# EAGLE schematic TankWaterControllerV5.1.10 (EAGLE 9.6.2)
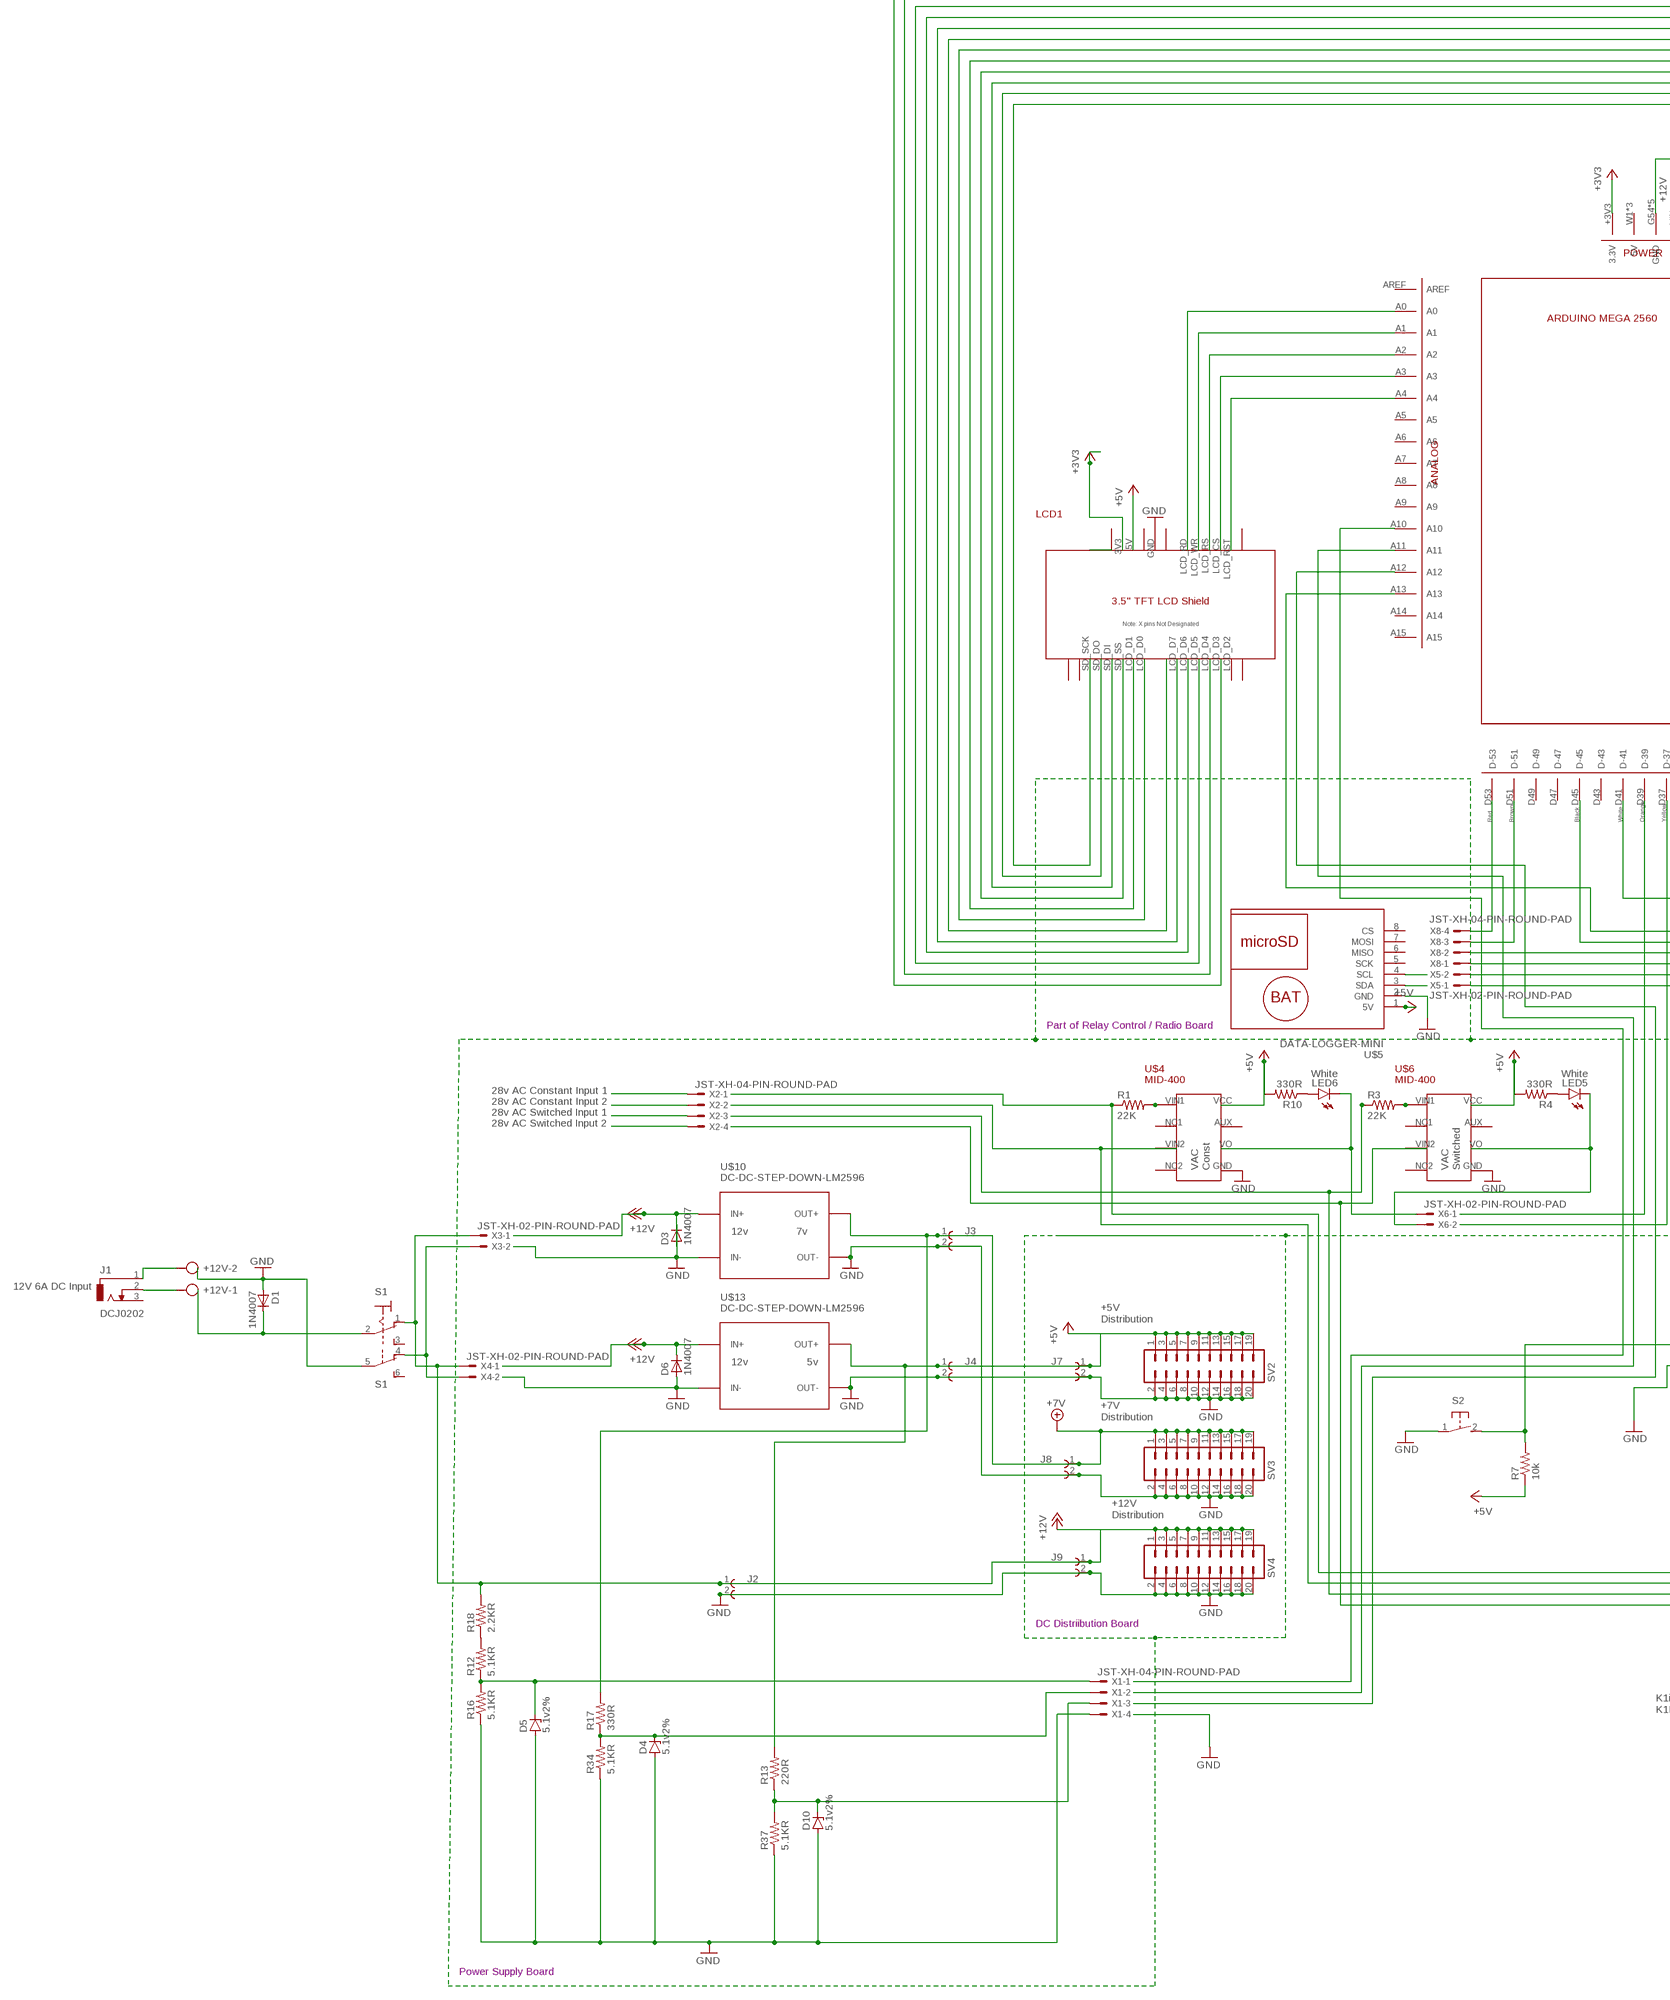
[diagram p0: schematic, sheet 1, part 1 of 2]
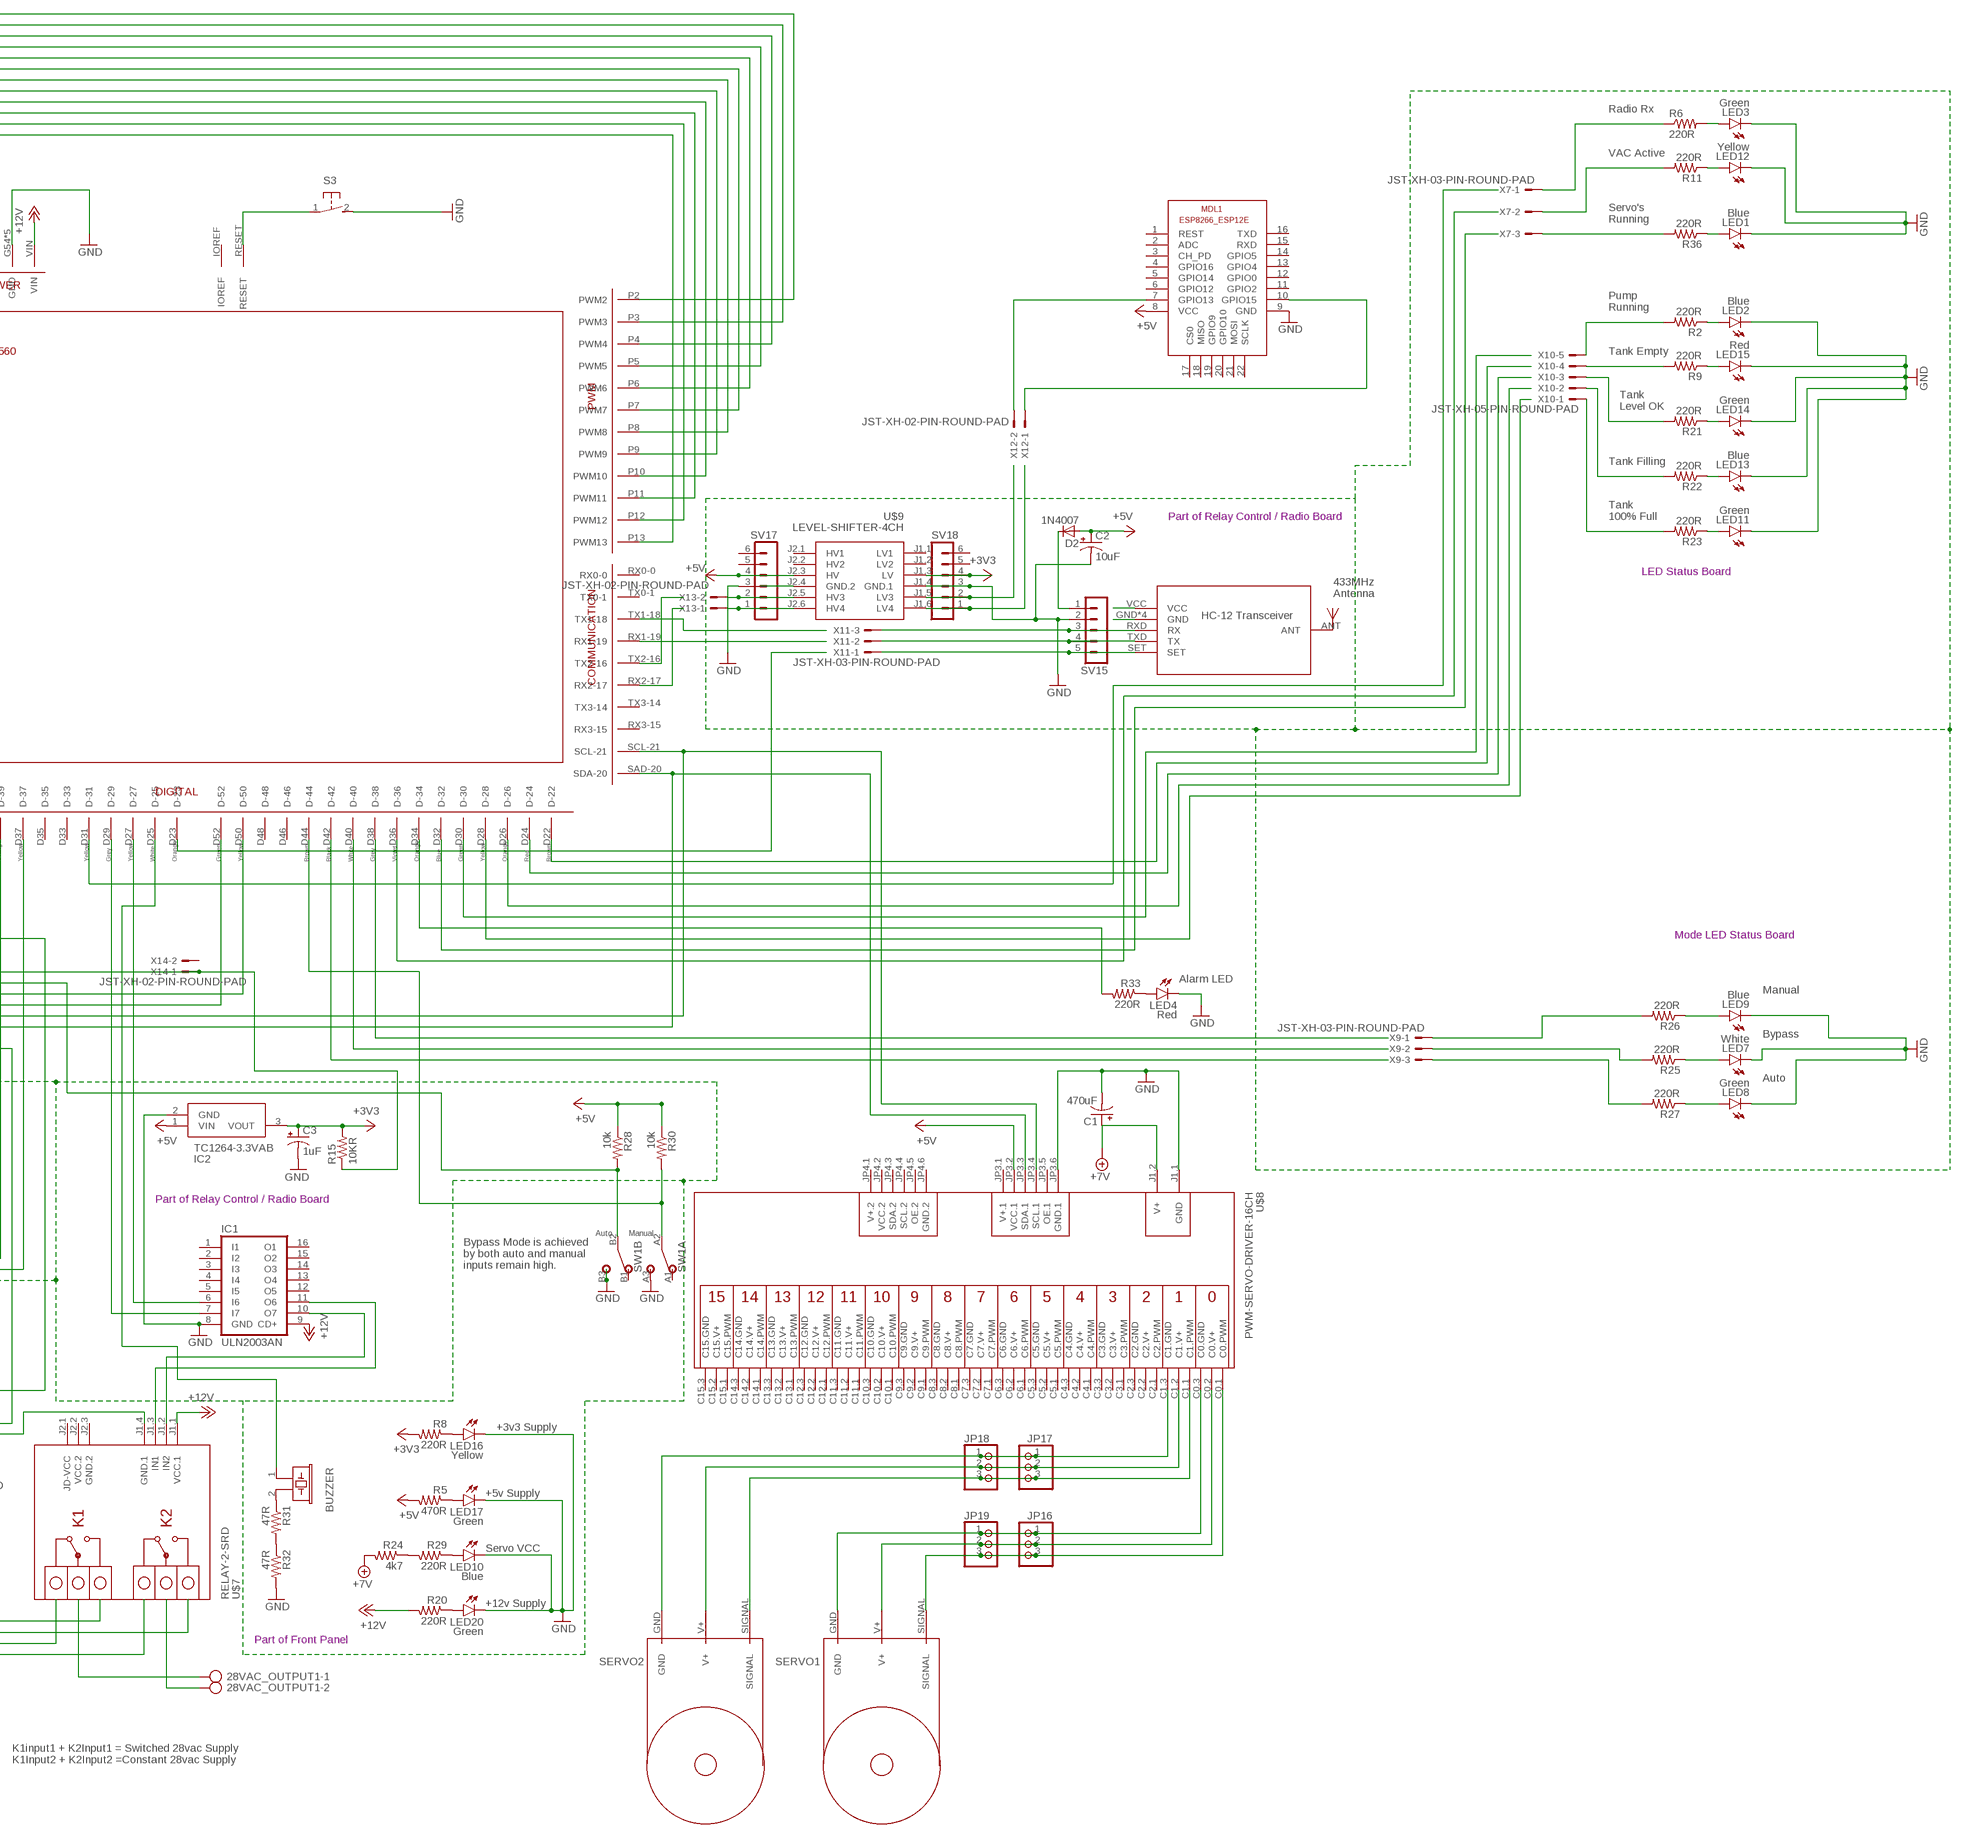
[diagram p1: schematic, sheet 1, part 2 of 2]

## Parts
28VAC_OUTPUT1  AK300/2  [AK300/2]
+12V  AK300/2  [AK300/2]
BUZZER  EFBAA40D101  [EFBAA40D101]
C1  470uF  CPOL-USB45181A  [B45181A]
C2  10uF  CPOL-USB45181A  [B45181A]
C3  1uF  CPOL-USB45181A  [B45181A]
D1  1N4007  [SMA]
D2  1N4007  [SMA]
D3  1N4007  [SMA]
D4  5.1v2%  ZENER-DIODEZD-5  [ZDIO-5]
D5  5.1v2%  ZENER-DIODEZD-5  [ZDIO-5]
D6  1N4007  [SMA]
D10  5.1v2%  ZENER-DIODEZD-5  [ZDIO-5]
IC1  ULN2003AN  [DIL16]
IC2  TC1264-3.3VAB  [TO254P483X988X2222-3P]
J1  DCJ0202  [DCJ0202]
J2  691101710002  [691101710002]
J3  691101710002  [691101710002]
J4  691101710002  [691101710002]
J7  691101710002  [691101710002]
J8  691101710002  [691101710002]
J9  691101710002  [691101710002]
JP16  PINHD-1X3/L90  [1X03/90]
JP17  PINHD-1X3/L90  [1X03/90]
JP18  PINHD-1X3/L90  [1X03/90]
JP19  PINHD-1X3/L90  [1X03/90]
LCD1  LCD_TOUCH_SHIELD  [LCD_TOUCH_3.5]
LED1  Blue  LED3MM  [LED3MM]
LED2  Blue  LED3MM  [LED3MM]
LED3  Green  LED3MM  [LED3MM]
LED4  Red  LED3MM  [LED3MM]
LED5  White  LED3MM  [LED3MM]
LED6  White  LED3MM  [LED3MM]
LED7  White  LED3MM  [LED3MM]
LED8  Green  LED3MM  [LED3MM]
LED9  Blue  LED3MM  [LED3MM]
LED10  Blue  LED3MM  [LED3MM]
LED11  Green  LED3MM  [LED3MM]
LED12  Yellow  LED3MM  [LED3MM]
LED13  Blue  LED3MM  [LED3MM]
LED14  Green  LED3MM  [LED3MM]
LED15  Red  LED3MM  [LED3MM]
LED16  Yellow  LED3MM  [LED3MM]
LED17  Green  LED3MM  [LED3MM]
LED20  Green  LED3MM  [LED3MM]
MDL1  ESP8266-12EESP8266-ESP12E  [ESP8266-ESP12E]
R1  22K  R-US_0204/5  [0204/5]
R2  220R  R-US_0204/5  [0204/5]
R3  22K  R-US_0204/5  [0204/5]
R4  330R  R-US_0204/5  [0204/5]
R5  470R  R-US_0204/5  [0204/5]
R6  220R  R-US_0204/5  [0204/5]
R7  10k  R-US_0204/5  [0204/5]
R8  220R  R-US_0204/5  [0204/5]
R9  220R  R-US_0204/5  [0204/5]
R10  330R  R-US_0204/5  [0204/5]
R11  220R  R-US_0204/5  [0204/5]
R12  5.1KR  R-US_0204/5  [0204/5]
R13  220R  R-US_0204/5  [0204/5]
R15  10KR  R-US_0204/5  [0204/5]
R16  5.1KR  R-US_0204/5  [0204/5]
R17  330R  R-US_0204/5  [0204/5]
R18  2.2KR  R-US_0204/5  [0204/5]
R20  220R  R-US_0204/5  [0204/5]
R21  220R  R-US_0204/5  [0204/5]
R22  220R  R-US_0204/5  [0204/5]
R23  220R  R-US_0204/5  [0204/5]
R24  4k7  R-US_0204/5  [0204/5]
R25  220R  R-US_0204/5  [0204/5]
R26  220R  R-US_0204/5  [0204/5]
R27  220R  R-US_0204/5  [0204/5]
R28  10k  R-US_0204/5  [0204/5]
R29  220R  R-US_0204/5  [0204/5]
R30  10k  R-US_0204/5  [0204/5]
R31  47R  R-US_0204/5  [0204/5]
R32  47R  R-US_0204/5  [0204/5]
R33  220R  R-US_0204/5  [0204/5]
R34  5.1KR  R-US_0204/5  [0204/5]
R36  220R  R-US_0204/5  [0204/5]
R37  5.1KR  R-US_0204/5  [0204/5]
S1  320-938  [320-938]
S2  31-XX  [B3F-31XX]
S3  31-XX  [B3F-31XX]
SERVO1  SERVO-DCBASIC_DC_SERVO  [BASIC_DC_SERVO]
SERVO2  SERVO-DCBASIC_DC_SERVO  [BASIC_DC_SERVO]
SV2  MA10-2W  [MA10-2W]
SV3  MA10-2W  [MA10-2W]
SV4  MA10-2W  [MA10-2W]
SV15  MA05-1  [MA05-1]
SV17  MA06-1  [MA06-1]
SV18  MA06-1  [MA06-1]
SW1  3PDT  [3PDT]
U$1  BOARD_ARDUINO-MEGA  [BOARD_ARDUINO_MEGA]
U$2  HC-12_FOOTPRINT  [HC-12_FOOTPRINT]
U$3  ANTENNA  [ANTENNA]
U$4  MID-400  [MID-400]
U$5  DATA-LOGGER-MINI  [DATA-LOGGER-MINI]
U$6  MID-400  [MID-400]
U$7  RELAY-2-SRD  [RELAY-2-SRD]
U$8  PWM-SERVO-DRIVER-16CH  [PWM-SERVO-DRIVER-16CH]
U$9  LEVEL-SHIFTER-4CH  [LEVEL-SHIFTER-4CH]
U$10  DC-DC-STEP-DOWN-LM2596  [DC-DC-STEP-DOWN-LM2596]
U$13  DC-DC-STEP-DOWN-LM2596  [DC-DC-STEP-DOWN-LM2596]
X1  JST-XH-04-PIN-ROUND-PAD  [JST-XH-04-PACKAGE-ROUND-PAD]
X2  JST-XH-04-PIN-ROUND-PAD  [JST-XH-04-PACKAGE-ROUND-PAD]
X3  JST-XH-02-PIN-ROUND-PAD  [JST-XH-02-PACKAGE-ROUND-PAD]
X4  JST-XH-02-PIN-ROUND-PAD  [JST-XH-02-PACKAGE-ROUND-PAD]
X5  JST-XH-02-PIN-ROUND-PAD  [JST-XH-02-PACKAGE-ROUND-PAD]
X6  JST-XH-02-PIN-ROUND-PAD  [JST-XH-02-PACKAGE-ROUND-PAD]
X7  JST-XH-03-PIN-ROUND-PAD  [JST-XH-03-PACKAGE-ROUND-PAD]
X8  JST-XH-04-PIN-ROUND-PAD  [JST-XH-04-PACKAGE-ROUND-PAD]
X9  JST-XH-03-PIN-ROUND-PAD  [JST-XH-03-PACKAGE-ROUND-PAD]
X10  JST-XH-05-PIN-ROUND-PAD  [JST-XH-05-PACKAGE-ROUND-PAD]
X11  JST-XH-03-PIN-ROUND-PAD  [JST-XH-03-PACKAGE-ROUND-PAD]
X12  JST-XH-02-PIN-ROUND-PAD  [JST-XH-02-PACKAGE-ROUND-PAD]
X13  JST-XH-02-PIN-ROUND-PAD  [JST-XH-02-PACKAGE-ROUND-PAD]
X14  JST-XH-02-PIN-ROUND-PAD  [JST-XH-02-PACKAGE-ROUND-PAD]

## Nets
+3V3: C3.+ IC2.3(VOUT) LCD1.3V3 R8.2 R15.2 SV18.4 U$1.+3V3(3.3V) U$9.J1.3(LV)
+5V: C2.+ D2.A IC2.1(VIN) LCD1.5V MDL1.8(VCC) R4.2 R5.2 R7.1 R10.2 R28.1 R30.1 SV2.1 SV2.3 SV2.5 SV2.7 SV2.9 SV2.11 SV2.13 SV2.15 SV2.17 SV2.19 SV17.4 U$4.VCC U$5.1(5V) U$6.VCC U$8.JP3.2(VCC.1) U$9.J2.3(HV)
+7V: J3.1 J8.1 R17.2 R24.2 U$10.OUT+
+12V: D3.A D6.K(C) IC1.9(CD+) R20.2 SV4.1 SV4.3 SV4.5 SV4.7 SV4.9 SV4.11 SV4.13 SV4.15 SV4.17 SV4.19 U$1.VIN U$7.J1.1(VCC.1) U$10.IN+ U$13.IN+
GND: C1.- C2.- C3.- D1.A D3.K(C) D4.A D5.A D6.A D10.A IC1.8(GND) IC2.2(GND) J2.2 J3.2 J4.2 J7.2 J8.2 J9.2 LED1.K(C) LED2.K(C) LED3.K(C) LED4.K(C) LED7.K(C) LED8.K(C) LED9.K(C) LED10.K(C) LED11.K(C) LED12.K(C) LED13.K(C) LED14.K(C) LED15.K(C) LED16.K(C) LED17.K(C) LED20.K(C) MDL1.9(GND) R16.1 R32.2 R34.1 R37.1 S1.5(B:P) S2.1(P) S3.2(S) SV2.2 SV2.4 SV2.6 SV2.8 SV2.10 SV2.12 SV2.14 SV2.16 SV2.18 SV2.20 SV3.2 SV3.4 SV3.6 SV3.8 SV3.10 SV3.12 SV3.14 SV3.16 SV3.18 SV3.20 SV4.2 SV4.4 SV4.6 SV4.8 SV4.10 SV4.12 SV4.14 SV4.16 SV4.18 SV4.20 SV15.2 SV17.3 SV18.3 SW1.A3 SW1.B3 U$1.G54(GND) U$1.G55(GND) U$1.G56(GND) U$1.G57(GND) U$1.G58(GND) U$5.2(GND) U$7.J1.4(GND.1) U$8.J1.1(GND) U$8.JP3.6(GND.1) U$9.J1.4(GND.1) U$10.IN- U$10.OUT- U$13.IN- U$13.OUT- X1.4
N$1: LCD1.P$28(X8)
N$2: R25.2 X9.2
N$3: +12V.1 J1.2
N$4: D1.K(C) S1.2(1:P)
N$5: LCD1.LCD_RD U$1.A0
N$6: LCD1.LCD_WR U$1.A1
N$7: LCD1.LCD_RS U$1.A2
N$8: LCD1.LCD_CS U$1.A3
N$9: LCD1.LCD_RST U$1.A4
N$10: LCD1.SD_SCK U$1.P13(PWM13)
N$11: LCD1.SD_DO U$1.P12(PWM12)
N$12: LCD1.SD_DI U$1.P11(PWM11)
N$13: LCD1.SD_SS U$1.P10(PWM10)
N$14: LCD1.LCD_D1 U$1.P9(PWM9)
N$15: LCD1.LCD_D0 U$1.P8(PWM8)
N$16: LCD1.P$2(X2) U$1.P7(PWM7)
N$17: LCD1.LCD_D7 U$1.P6(PWM6)
N$18: LCD1.LCD_D6 U$1.P5(PWM5)
N$19: LCD1.LCD_D5 U$1.P4(PWM4)
N$20: LCD1.LCD_D4 U$1.P3(PWM3)
N$21: LCD1.LCD_D3 U$1.P2(PWM2)
N$22: U$1.D50(D-50) X8.2
N$23: MDL1.7(GPIO13) X12.2
N$24: U$2.ANT U$3.ANT
N$25: U$1.D51(D-51) X8.3
N$26: LED16.A R8.1
N$27: U$4.VIN2
N$28: R3.1
N$29: IC1.11(O6) U$7.J1.3(IN1)
N$30: LED6.K(C) U$4.VO(V0) X6.1
N$31: U$6.VIN2
N$32: LED1.A R36.1
N$34: U$1.D52(D-52) X8.1
N$35: R1.2
N$36: R3.2
N$38: R1.1
N$39: U$1.D36(D-36)
N$40: +12V.2 J1.1
N$41: IC1.7(I7) U$1.D29(D-29)
N$42: IC1.6(I6) U$1.D27(D-27)
N$44: 28VAC_OUTPUT1.1
N$45: X2.3
N$46: IC1.10(O7) U$7.J1.2(IN2)
N$47: 28VAC_OUTPUT1.2
N$48: U$1.A10
N$49: LED6.A R10.1
N$50: D5.C R12.1 R16.2 X1.1
N$51: R30.2 SW1.A2 U$1.D44(D-44)
N$52: R28.2 SW1.B2 U$1.D45(D-45)
N$53: R12.2 R18.1
N$54: JP17.2 JP18.2 SERVO2.V+ U$8.C1.2(C1.V+)
N$55: U$1.SCL-21 U$8.JP3.4(SCL.1) X5.2
N$56: D10.C R13.1 R37.2 X1.3
N$57: U$5.4(SCL)
N$58: U$2.VCC
N$59: LED11.A R23.1
N$60: LED20.A R20.1
N$61: LED5.A R4.1
N$62: X2.4
N$63: U$1.A12
N$64: LED17.A R5.1
N$65: U$2.GND U$2.GND1(GND) U$2.GND2(GND) U$2.MCHFIX(GND)
N$66: LED9.A R26.1
N$67: U$5.3(SDA)
N$68: S3.1(P) U$1.RESET
N$69: U$1.D53(D-53) X8.4
N$70: R26.2 X9.1
N$71: U$1.SAD-20(SDA-20) U$8.JP3.3(SDA.1) X5.1
N$72: SV15.3 U$2.RXD(RX) X11.3
N$73: U$1.D22(D-22)
N$74: SV15.4 U$2.TXD(TX) X11.2
N$75: MDL1.10(GPIO15) X12.1
N$76: LED3.A R6.2
N$77: R27.2 X9.3
N$78: BUZZER.1 U$1.D25(D-25)
N$79: X2.1
N$80: U$1.D39(D-39)
N$81: LED7.A R25.1
N$82: LED12.A R11.1
N$83: LED15.A R9.1
N$84: U$1.RX2-17
N$85: LED2.A R2.1
N$86: U$1.D38(D-38)
N$87: U$1.TX1-18
N$88: U$1.D42(D-42)
N$89: U$1.D40(D-40)
N$90: S1.4(B:O) X3.2 X4.2
N$91: U$1.TX2-16
N$92: BUZZER.2 R31.1
N$93: U$1.D26(D-26)
N$94: U$1.D28(D-28)
N$95: LED8.A R27.1
N$96: D2.K(C) SV15.1
N$97: U$1.D23(D-23)
N$98: U$9.J2.4(GND.2)
N$99: U$1.D32(D-32)
N$100: SV18.2 U$9.J1.5(LV3)
N$101: U$1.D30(D-30)
N$102: R31.2 R32.1
N$103: R24.1 R29.2
N$104: LED13.A R22.1
N$105: LED14.A R21.1
N$106: LED10.A R29.1
N$107: J2.1 J9.1 R18.2 S1.1(1:O) X3.1 X4.1
N$108: U$1.D24(D-24)
N$109: U$1.D31(D-31)
N$111: J4.1 J7.1 R13.2 U$13.OUT+
N$112: U$1.RX1-19
N$113: X2.2
N$114: LED4.A R33.1
N$115: R7.2 S2.2(S) U$1.D41(D-41)
N$116: U$1.D37(D-37)
N$117: LED5.K(C) U$6.VO(V0) X6.2
N$118: U$1.A11
N$119: R33.2 U$1.D34(D-34)
N$120: JP16.1 JP19.1 SERVO1.GND U$8.C0.3(C0.GND)
N$121: R6.1 X7.1
N$122: JP17.1 JP18.1 SERVO2.GND U$8.C1.3(C1.GND)
N$124: SV15.5 U$2.SET X11.1
N$125: SV18.1 U$9.J1.6(LV4)
N$126: JP16.2 JP19.2 SERVO1.V+ U$8.C0.2(C0.V+)
N$127: JP16.3 JP19.3 SERVO1.SIGNAL U$8.C0.1(C0.PWM)
N$128: C1.+ U$8.J1.2(V+) ; supply symbol labelled +7V
N$129: SV17.1 U$9.J2.6(HV4) X13.1
N$130: R11.2 X7.2
N$131: JP17.3 JP18.3 SERVO2.SIGNAL U$8.C1.1(C1.PWM)
N$132: R36.2 X7.3
N$133: R2.2 X10.5
N$134: R9.2 X10.4
N$135: R21.2 X10.3
N$136: R22.2 X10.2
N$137: R23.2 X10.1
N$138: SV17.2 U$9.J2.5(HV3) X13.2
N$139: SV3.1 SV3.3 SV3.5 SV3.7 SV3.9 SV3.11 SV3.13 SV3.15 SV3.17 SV3.19
N$142: R15.1 U$1.A13 X14.1
N$143: D4.C R17.1 R34.2 X1.2
Unconnected: IC1.1(I1) IC1.2(I2) IC1.3(I3) IC1.4(I4) IC1.5(I5) IC1.12(O5) IC1.13(O4) IC1.14(O3) IC1.15(O2) IC1.16(O1) J1.3 LCD1.GND LCD1.LCD_D2 LCD1.P$1(X1) LCD1.P$7(X3) LCD1.P$8(X4) LCD1.P$17(X5) LCD1.P$23(X6) LCD1.P$25(X7) MDL1.1(REST) MDL1.2(ADC) MDL1.3(CH_PD) MDL1.4(GPIO16) MDL1.5(GPIO14) MDL1.6(GPIO12) MDL1.11(GPIO2) MDL1.12(GPIO0) MDL1.13(GPIO4) MDL1.14(GPIO5) MDL1.15(RXD) MDL1.16(TXD) MDL1.17(CS0) MDL1.18(MISO) MDL1.19(GPIO9) MDL1.20(GPIO10) MDL1.21(MOSI) MDL1.22(SCLK) S1.3(1:S) S1.6(B:S) SV17.5 SV17.6 SV18.5 SV18.6 SW1.A1 SW1.B1 SW1.C1 SW1.C2 SW1.C3 U$1.A5 U$1.A6 U$1.A7 U$1.A8 U$1.A9 U$1.A14 U$1.A15 U$1.AREF U$1.D33(D-33) U$1.D35(D-35) U$1.D43(D-43) U$1.D46(D-46) U$1.D47(D-47) U$1.D48(D-48) U$1.D49(D-49) U$1.IOREF U$1.RX0-0 U$1.RX3-15 U$1.TX0-1 U$1.TX3-14 U$4.AUX U$4.GND U$4.NC1 U$4.NC2 U$4.VIN1 U$5.5(SCK) U$5.6(MISO) U$5.7(MOSI) U$6.AUX U$6.GND U$6.NC1 U$6.NC2 U$6.VIN1 U$7.J2.1(JD-VCC) U$8.C2.1(C2.PWM) U$8.C2.2(C2.V+) U$8.C2.3(C2.GND) U$8.C3.1(C3.PWM) U$8.C3.2(C3.V+) U$8.C3.3(C3.GND) U$8.C4.1(C4.PWM) U$8.C4.2(C4.V+) U$8.C4.3(C4.GND) U$8.C5.1(C5.PWM) U$8.C5.2(C5.V+) U$8.C5.3(C5.GND) U$8.C6.1(C6.PWM) U$8.C6.2(C6.V+) U$8.C6.3(C6.GND) U$8.C7.1(C7.PWM) U$8.C7.2(C7.V+) U$8.C7.3(C7.GND) U$8.C8.1(C8.PWM) U$8.C8.2(C8.V+) U$8.C8.3(C8.GND) U$8.C9.1(C9.PWM) U$8.C9.2(C9.V+) U$8.C9.3(C9.GND) U$8.C10.1(C10.PWM) U$8.C10.2(C10.V+) U$8.C10.3(C10.GND) U$8.C11.1(C11.PWM) U$8.C11.2(C11.V+) U$8.C11.3(C11.GND) U$8.C12.1(C12.PWM) U$8.C12.2(C12.V+) U$8.C12.3(C12.GND) U$8.C13.1(C13.PWM) U$8.C13.2(C13.V+) U$8.C13.3(C13.GND) U$8.C14.1(C14.PWM) U$8.C14.2(C14.V+) U$8.C14.3(C14.GND) U$8.C15.1(C15.PWM) U$8.C15.2(C15.V+) U$8.C15.3(C15.GND) U$8.JP3.5(OE.1) U$8.JP4.3(SDA.2) U$8.JP4.4(SCL.2) U$8.JP4.5(OE.2) U$9.J1.1(LV1) U$9.J1.2(LV2) U$9.J2.1(HV1) U$9.J2.2(HV2) X14.2

## Notes on the sheet
- Radio Rx
- VAC Active
- Servo's
  Running
- Pump
  Running
- Tank Empty
- Tank 
  Level OK
- Tank Filling
- Part of Relay Control / Radio Board
- Tank 
  100% Full
- LED Status Board
- 433MHz
  Antenna
- HC-12 Transceiver
- Red | Brown | Black | White | Orange | Yellow | Yellow | Grey | Yellow | White | Orange | Green | Yellow | Brown | Black | White | Grey | Violet | Orange | Blue | Green | Yellow | Orange | Red | Brown
- Mode LED Status Board
- Alarm LED
- Manual
- Bypass
- Part of Relay Control / Radio Board
- Auto
- 28v AC Constant Input 1
- 28v AC Constant Input 2
- 28v AC Switched Input 1
- 28v AC Switched Input 2
- Part of Relay Control / Radio Board
- VAC 
  Const
- VAC 
  Switched
- Auto | Manual
- Bypass Mode is achieved
  by both auto and manual 
  inputs remain high.
- 12v | 7v
- 12V 6A DC Input
- +5V
  Distribution
- 12v | 5v | +3v3 Supply
- +7V
  Distribution
- +5v Supply
- Servo VCC
- +12V
  Distribution
- +12v Supply
- Part of Front Panel
- DC Distriibution Board
- K1input1 + K2Input1 = Switched 28vac Supply 
  K1Input2 + K2Input2 =Constant 28vac Supply
- Power Supply Board

## Power pins joined to a net without a drawn wire
5V: U$1.W1(5V) U$1.W2(5V) U$1.W3(5V)
CS: U$5.8(CS)
GND.2: U$7.J2.3(GND.2) U$8.JP4.6(GND.2)
V+.1: U$8.JP3.1(V+.1)
V+.2: U$8.JP4.1(V+.2)
VCC.2: U$7.J2.2(VCC.2) U$8.JP4.2(VCC.2)

## Library data of the parts
28VAC_OUTPUT1 +12V = con-ptr500:AK300/2: CONNECTOR; OC_FARNELL: unknown; OC_NEWARK: unknown
BUZZER = buzzer:EFB?: Piezoelectric Acoustic Transducer Source: Panbasonic .. 2SC1685.pdf; OC_FARNELL: unknown; OC_NEWARK: unknown
C1-C3 = resistor:CPOL-US: POLARIZED CAPACITOR, American symbol
D1-D3 D6 = casovac:1N4007
D4 D5 D10 = diode:ZENER-DIODE: Z-Diode
IC1 = uln-udn:ULN2003A: DRIVER ARRAY
IC2 = TC1264-3.3VAB:TC1264-3.3VAB: LDO Regulator 3.3V 800mA Shutdown TO220 Microchip TC1264-3.3VAB, LDO Voltage Regulator, 800mA, 3.3 V 0.5%, 2.7 6 Vin, 3-Pin TO-220 Source: Datasheet <http://uk.rs-online.com/web/p/products/7747655>; ALLIED_NUMBER: 70414997; ALLIED_PRICE/STOCK: https://www.alliedelec.com/microchip-technology-inc-tc1264-3-3vab/70414997/; ARROW_PART_NUMBER: TC1264-3.3VAB; ARROW_PRICE/STOCK: https://www.arrow.com/en/products/tc1264-3.3vab/microchip-technology; DESCRIPTION: LDO Regulator 3.3V 800mA Shutdown TO220 Microchip TC1264-3.3VAB, LDO Voltage Regulator, 800mA, 3.3 V 0.5%, 2.7 6 Vin, 3-Pin TO-220; HEIGHT: 4.826mm; MANUFACTURER_NAME: Microchip; MANUFACTURER_PART_NUMBER: TC1264-3.3VAB; RS_PART_NUMBER: 7747655P; RS_PRICE/STOCK: http://uk.rs-online.com/web/p/products/7747655P
J1 = con-jack:DCJ0202: DC POWER JACK Source: DCJ0202.pdf; OC_FARNELL: unknown; OC_NEWARK: unknown
J2-J4 J7-J9 = Wurth_Elektronik_Electromechanic_Terminal_Blocks_Connectors_rev16b:691101710002: WR-TBL Serie 101 - 5.0mm HOrizontal Entry Modular with Pressure Clamp - 2.5mm2 Wires , 2 pins=>Code : Con-TBL_Screw_PressureClamp_691101710002 <http://katalog.we-online.de/media/images/eican/Con-TBL_Screw_PressureClamp_6911017100xx_pf2.jpg> Details see: http://katalog.we-online.de/en/em/691_101_710_0xx Created 2014-06-16, Karrer Zheng 2014 (C) Würth Elektronik
JP16-JP19 = pinhead_v2:PINHD-1X3: PIN HEADER
LCD1 = LCD_Touch:LCD_TOUCH_SHIELD: Generic_LCD_Touch_3.5_Shield
LED1-LED17 LED20 = led:LED: LED OSRAM: - CHIPLED LG R971, LG N971, LY N971, LG Q971, LY Q971, LO R971, LY R971 LH N974, LH R974 LS Q976, LO Q976, LY Q976 LO Q996 - Hyper CHIPLED LW Q18S LB Q993, LB Q99A, LB R99A - SideLED LS A670, LO A670, LY A670, LG A670, LP A670 LB A673, LV A673, LT A673, LW A673 LH A674 LY A675 LS A676, LA A676, LO A676, LY A676, LW A676 LS A679, LY A679, LG A679 - Hyper Micro SIDELED® LS Y876, LA Y876, LO Y876, LY Y876 LT Y87S - SmartLED LW L88C, LW L88S LB L89C, LB L89S, LG L890 LS L89K, LO L89K, LY L89K LS L896, LA L896, LO L896, LY L896 - TOPLED LS T670, LO T670, LY T670, LG T670, LP T670 LSG T670, LSP T670, LSY T670, LOP T670, LYG T670 LG T671, LOG T671, LSG T671 LB T673, LV T673, LT T673, LW T673 LH T674 LS T676, LA T676, LO T676, LY T676, LB T676, LH T676, LSB T676, LW T676 LB T67C, LV T67C, LT T67C, LS T67K, LO T67K, LY T67K, LW E67C LS E67B, LA E67B, LO E67B, LY E67B, LB E67C, LV E67C, LT E67C LW T67C LS T679, LY T679, LG T679 LS T770, LO T770, LY T770, LG T770, LP T770 LB T773, LV T773, LT T773, LW T773 LH T774 LS E675, LA E675, LY E675, LS T675 LS T776, LA T776, LO T776, LY T776, LB T776 LHGB T686 LT T68C, LB T68C - Hyper Mini TOPLED® LB M676 - Mini TOPLED Santana® LG M470 LS M47K, LO M47K, LY M47K Source: http://www.osram.convergy.de LUXEON: - LUMILED® LXK2-PW12-R00, LXK2-PW12-S00, LXK2-PW14-U00, LXK2-PW14-V00 LXK2-PM12-R00, LXK2-PM12-S00, LXK2-PM14-U00 LXK2-PE12-Q00, LXK2-PE12-R00, LXK2-PE12-S00, LXK2-PE14-T00, LXK2-PE14-U00 LXK2-PB12-K00, LXK2-PB12-L00, LXK2-PB12-M00, LXK2-PB14-N00, LXK2-PB14-P00, LXK2-PB14-Q00 LXK2-PR12-L00, LXK2-PR12-M00, LXK2-PR14-Q00, LXK2-PR14-R00 LXK2-PD12-Q00, LXK2-PD12-R00, LXK2-PD12-S00 LXK2-PH12-R00, LXK2-PH12-S00 LXK2-PL12-P00, LXK2-PL12-Q00, LXK2-PL12-R00 Source: www.luxeon.com KINGBRIGHT: KA-3528ASYC Source: www.kingbright.com
MDL1 = ESP8266-ESP12E:ESP8266-12E: ESP8266-12E with additional I/O and GPIO04/05 corrected The author cannot warrant that this library is free from error or will meet your specific requirements. Created by PuceBaboon.com. Komagane, Nagano, JAPAN
R1-R13 R15-R18 R20-R34 R36 R37 = resistor:R-US_: RESISTOR, American symbol
S1 = switch:320-938: TOGGLE SWITCH distributor RS Components
S2 S3 = switch-omron:31-XX: OMRON SWITCH; MPN: B3F-3100; OC_FARNELL: 959704; OC_NEWARK: 36M3582
SERVO1 SERVO2 = ServoDC:SERVO-DC: Basic 3 pin DC Servo
SV2-SV4 = con-lstb:MA10-2W: PIN HEADER; OC_FARNELL: unknown; OC_NEWARK: unknown
SV15 = con-lstb:MA05-1: PIN HEADER; OC_FARNELL: unknown; OC_NEWARK: unknown
SV17 SV18 = con-lstb:MA06-1: PIN HEADER; OC_FARNELL: unknown; OC_NEWARK: unknown
SW1 = gm-switches:3PDT
U$1 = Clean-Kong:BOARD_ARDUINO-MEGA
U$2 = hc12_433mhz:HC-12_FOOTPRINT: HC-12 433MHz module footprint MCHFIX is for mechanical fix pin which is NC but on this file connected to GND https://github.com/meendiz/hc-12_si4463/
U$3 = computronics.com.au:ANTENNA: Antenna - single wire
U$4 U$6 = MID400:MID-400
U$5 = diy-modules:DATA-LOGGER-MINI: Mini Data Logger with microSD card and battery powered RTC based on DS1307 chip Arduino library for DS1307 and description are available here: https://www.pjrc.com/teensy/td_libs_DS1307RTC.html Tutorial how to use SD card with Arduino: https://www.arduino.cc/en/reference/SD Click here to find device on ebay.com <http://www.ebay.com/sch/mini+data+logger+arduino>
U$7 = diy-modules:RELAY-2-SRD: 2-Channel Relay Module based on SRD-05VDC-SL-C relays Click here to find device on ebay.com <http://www.ebay.com/sch/two+channel+relay+module+optocoupler+5v>
U$8 = diy-modules:PWM-SERVO-DRIVER-16CH: 16-Channel 12-bit PWM/Servo Driver based on PCA9685 chip PCA9685 datasheet is available here: http://www.nxp.com/documents/data_sheet/PCA9685.pdf Arduino Library for PCA9685 is available here: https://github.com/kasperskaarhoj/PCA9685-Arduino-Library Click here to find device on ebay.com <http://www.ebay.com/sch/pwm+servo+module+pca9685>
U$9 = diy-modules:LEVEL-SHIFTER-4CH: 4-Channel Bi-Directional Logic Level Converter based on BSS128 transistors Click here to find device on ebay.com <http://www.ebay.com/sch/i2c+logic+converter+module>
U$10 U$13 = diy-modules:DC-DC-STEP-DOWN-LM2596: DC/DC Step-Down Regulator based on LM2596-ADJ chip LM2596 datasheet available here: http://www.ti.com/lit/ds/symlink/lm2596.pdf Click here to find device on ebay.com <http://www.ebay.com/sch/lm2596+power+regulator>
X1 X2 X8 = Rembrandt Electronics - JST XH Connectors v1-0:JST-XH-04-PIN: JST XH Connector 2 Pin Wire to board connector. Pitch: 2,54 mm, (0.100") Number of pins: 4 Created by Rembrandt Electronics www.rembrandtelectronics.com
X3-X6 X12-X14 = Rembrandt Electronics - JST XH Connectors v1-0:JST-XH-02-PIN: JST XH Connector 2 Pin Wire to board connector. Pitch: 2,54 mm, (0.100") Number of pins: 2 Created by Rembrandt Electronics www.rembrandtelectronics.com
X7 X9 X11 = Rembrandt Electronics - JST XH Connectors v1-0:JST-XH-03-PIN: JST XH Connector 2 Pin Wire to board connector. Pitch: 2,54 mm, (0.100") Number of pins: 3 Created by Rembrandt Electronics www.rembrandtelectronics.com
X10 = Rembrandt Electronics - JST XH Connectors v1-0:JST-XH-05-PIN: JST XH Connector 2 Pin Wire to board connector. Pitch: 2,54 mm, (0.100") Number of pins: 5 Created by Rembrandt Electronics www.rembrandtelectronics.com